# EAGLE schematic untitled (EAGLE 5.11)
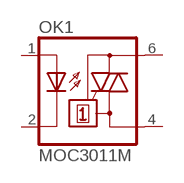
[diagram p0: schematic, sheet 1]

## Parts
OK1  MOC3011M  [DIL06]
Unconnected: OK1.1(A) OK1.2(C) OK1.4(A1) OK1.6(A2)

## Library data of the parts
OK1 = optocoupler:MOC30*M: RANDOM-PHASE OPTOISOLATORS TRIAC DRIVER OUTPUT Source: http://www.fairchildsemi.com MOC3020-M.pdf; MF: FAIRCHILD SEMICONDUCTOR; MPN: MOC3011-M; OC_FARNELL: 1021363; OC_NEWARK: 72K8893